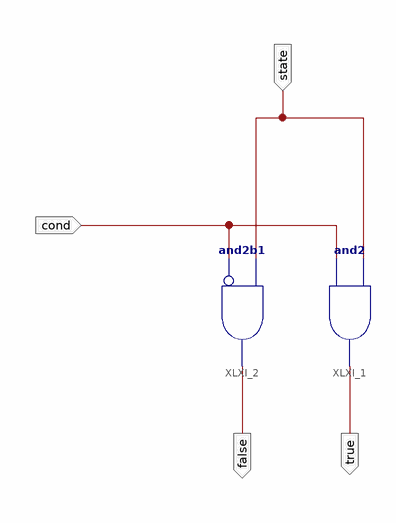
[diagram p0: schematic sheet 1]
// Xilinx ISE schematic ifblosk.sch (spartan6) as structural Verilog: 2 symbols, 4 ports
module ifblosk (
  input  cond,
  input  state,
  output false,
  output true
);

  and XLXI_1 (true, cond, state);
  and XLXI_2 (false, ~cond, state);  // and2b1
endmodule
